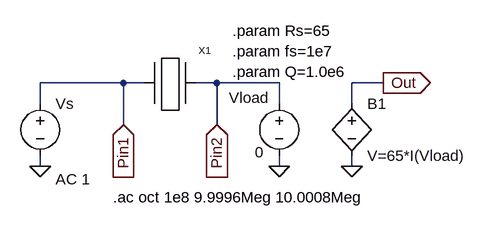
[diagram p0: schematic 05_CrystalModel_10MHz_0Z_ICVS_symbol.asc]
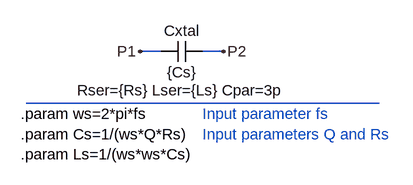
[diagram p1: sub-circuit xtal_param.asc]
05_CrystalModel_10MHz_0Z_ICVS_symbol.asc, the LTspice schematic file:
Version 4
SHEET 1 880 680
WIRE 0 272 -128 272
WIRE 32 272 0 272
WIRE 144 272 112 272
WIRE 240 272 144 272
WIRE 400 272 352 272
WIRE -128 304 -128 272
WIRE 240 304 240 272
WIRE 352 304 352 272
WIRE 0 336 0 272
WIRE 144 336 144 272
WIRE -128 400 -128 384
WIRE 240 400 240 384
WIRE 352 400 352 384
FLAG 0 336 Pin1
IOPIN 0 336 In
FLAG 144 336 Pin2
IOPIN 144 336 In
FLAG -128 400 0
FLAG 240 400 0
FLAG 352 400 0
FLAG 400 272 Out
IOPIN 400 272 Out
SYMBOL voltage -128 288 R0
WINDOW 123 24 132 Left 0
WINDOW 39 0 0 Left 0
SYMATTR Value2 AC 1
SYMATTR InstName Vs
SYMATTR Value ""
SYMBOL voltage 240 288 R0
WINDOW 0 -77 7 Left 0
WINDOW 3 -37 91 Left 0
WINDOW 123 0 0 Left 0
WINDOW 39 0 0 Left 0
SYMATTR InstName Vload
SYMATTR Value 0
SYMBOL bv 352 288 R0
SYMATTR InstName B1
SYMATTR Value V=65*I(Vload)
SYMBOL xtal_param 32 304 R0
SYMATTR InstName X1
TEXT -16 448 Left 0 !.ac oct 1e8 9.9996Meg 10.0008Meg
TEXT 168 192 Left 0 !.param Rs=65\n.param fs=1e7\n.param Q=1.0e6

xtal_param.asc, the sub-circuit schematic file:
Version 4
SHEET 1 880 680
WIRE 176 144 144 144
WIRE 272 144 240 144
FLAG 144 144 P1
FLAG 272 144 P2
SYMBOL cap 240 128 R90
WINDOW 0 0 32 VBottom 0
WINDOW 3 32 32 VTop 0
WINDOW 39 60 32 VTop 0
SYMATTR InstName Cxtal
SYMATTR Value {Cs}
SYMATTR SpiceLine Rser={Rs} Lser={Ls} Cpar=3p
TEXT -40 240 Left 0 !.param ws=2*pi*fs\n.param Cs=1/(ws*Q*Rs)\n.param Ls=1/(ws*ws*Cs)
TEXT 240 240 Left 0 ;Input parameter fs\nInput parameters Q and Rs
LINE Normal 512 224 -32 224

The netlist it stands for:
* 05_CrystalModel_10MHz_0Z_ICVS_symbol.asc
Vs Pin1 0 AC 1
Vload Pin2 0 0
B1 Out 0 V=65*I(Vload)
XX1 Pin1 Pin2 xtal_param

* block symbol definitions
.subckt xtal_param P1 P2
Cxtal P2 P1 {Cs} Rser={Rs} Lser={Ls} Cpar=3p
.param ws=2*pi*fs
.param Cs=1/(ws*Q*Rs)
.param Ls=1/(ws*ws*Cs)
* Input parameter fs
* Input parameters Q and Rs
.ends xtal_param

.ac oct 1e8 9.9996Meg 10.0008Meg
.param Rs=65
.param fs=1e7
.param Q=1.0e6
.backanno
.end